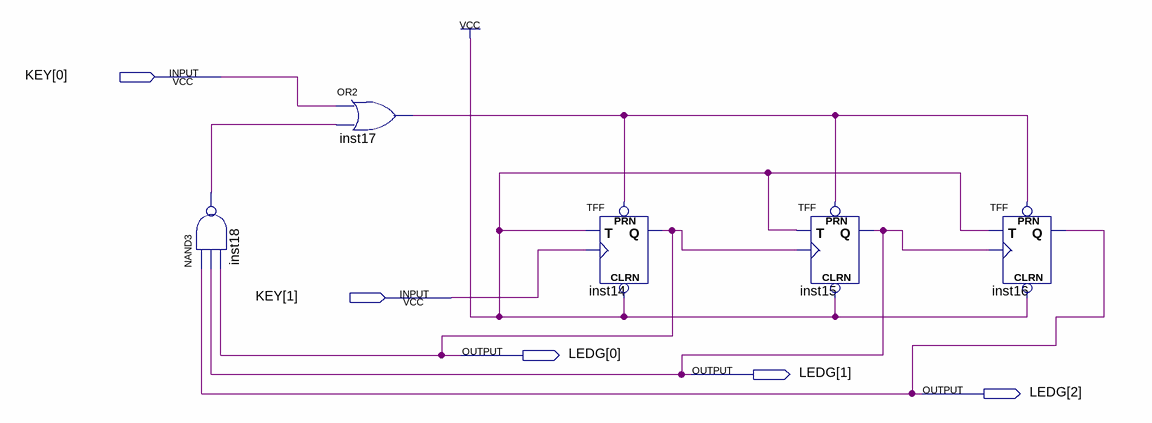
[diagram p0: schematic sheet]
// Quartus schematic Vidas_ContadorAssincrono.bdf as structural Verilog: 5 symbols, 5 pins
module Vidas_ContadorAssincrono (
  input  [1:0] KEY,
  output [2:0] LEDG
);

  wire inst17_out, inst18_out;

  nand inst18 (inst18_out, LEDG[2], LEDG[1], LEDG[0]);
  or inst17 (inst17_out, KEY[0], inst18_out);
  TFF inst14 (.PRN(inst17_out), .CLRN(1'b1), .T(1'b1), .CLK(KEY[1]), .Q(LEDG[0]));
  TFF inst15 (.PRN(inst17_out), .CLRN(1'b1), .T(1'b1), .CLK(LEDG[0]), .Q(LEDG[1]));
  TFF inst16 (.PRN(inst17_out), .CLRN(1'b1), .T(1'b1), .CLK(LEDG[1]), .Q(LEDG[2]));
endmodule
